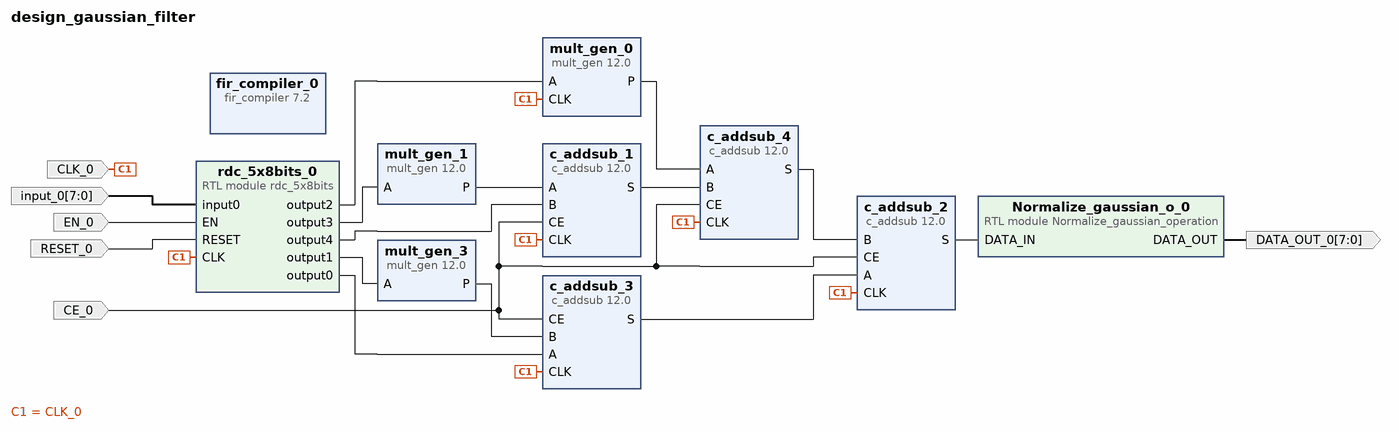
[diagram p0: block diagram of the top level]
# Vivado block design design_gaussian_filter, xc7z020clg400-1, Vivado 2018.2.1
create_bd_design design_gaussian_filter

create_bd_port -dir I -type clk CLK_0
set_property -dict {CONFIG.FREQ_HZ 10000000} [get_bd_ports CLK_0]
create_bd_port -dir I -from 7 -to 0 input_0
create_bd_port -dir I EN_0
create_bd_port -dir I -type rst RESET_0
create_bd_port -dir I -type ce CE_0
create_bd_port -dir O -from 7 -to 0 DATA_OUT_0

create_bd_cell -type ip -vlnv xilinx.com:ip:mult_gen:12.0 mult_gen_0
set_property -dict [list \
  CONFIG.MultType Constant_Coefficient_Multiplier \
  CONFIG.PortAType Unsigned \
  CONFIG.PortAWidth 8 \
  CONFIG.ConstValue 6 \
  CONFIG.PipeStages 2 \
] [get_bd_cells mult_gen_0]
create_bd_cell -type ip -vlnv xilinx.com:ip:mult_gen:12.0 mult_gen_1
set_property -dict [list \
  CONFIG.MultType Constant_Coefficient_Multiplier \
  CONFIG.PortAType Unsigned \
  CONFIG.PortAWidth 8 \
  CONFIG.ConstValue 4 \
] [get_bd_cells mult_gen_1]
create_bd_cell -type ip -vlnv xilinx.com:ip:mult_gen:12.0 mult_gen_3
set_property -dict [list \
  CONFIG.MultType Constant_Coefficient_Multiplier \
  CONFIG.PortAType Unsigned \
  CONFIG.PortAWidth 8 \
  CONFIG.ConstValue 4 \
] [get_bd_cells mult_gen_3]
create_bd_cell -type ip -vlnv xilinx.com:ip:c_addsub:12.0 c_addsub_1
set_property -dict [list \
  CONFIG.A_Type Signed \
  CONFIG.B_Type Unsigned \
  CONFIG.A_Width 11 \
  CONFIG.B_Width 8 \
  CONFIG.Out_Width 12 \
  CONFIG.Latency 1 \
  CONFIG.B_Value 00000000 \
] [get_bd_cells c_addsub_1]
create_bd_cell -type ip -vlnv xilinx.com:ip:c_addsub:12.0 c_addsub_2
set_property -dict [list \
  CONFIG.A_Type Signed \
  CONFIG.B_Type Signed \
  CONFIG.A_Width 12 \
  CONFIG.B_Width 13 \
  CONFIG.Out_Width 14 \
  CONFIG.Latency 1 \
  CONFIG.B_Value 0000000000000 \
] [get_bd_cells c_addsub_2]
create_bd_cell -type ip -vlnv xilinx.com:ip:c_addsub:12.0 c_addsub_3
set_property -dict [list \
  CONFIG.A_Type Unsigned \
  CONFIG.B_Type Signed \
  CONFIG.A_Width 8 \
  CONFIG.B_Width 11 \
  CONFIG.Out_Width 12 \
  CONFIG.Latency 1 \
  CONFIG.B_Value 00000000000 \
] [get_bd_cells c_addsub_3]
create_bd_cell -type ip -vlnv xilinx.com:ip:c_addsub:12.0 c_addsub_4
set_property -dict [list \
  CONFIG.A_Type Signed \
  CONFIG.B_Type Signed \
  CONFIG.A_Width 11 \
  CONFIG.B_Width 12 \
  CONFIG.Out_Width 13 \
  CONFIG.Latency 1 \
  CONFIG.B_Value 000000000000 \
] [get_bd_cells c_addsub_4]
create_bd_cell -type module -reference Normalize_gaussian_operation Normalize_gaussian_o_0
create_bd_cell -type module -reference rdc_5x8bits rdc_5x8bits_0
create_bd_cell -type ip -vlnv xilinx.com:ip:fir_compiler:7.2 fir_compiler_0
set_property -dict [list \
  CONFIG.CoefficientVector 1,4,7,4,1 \
  CONFIG.Coefficient_Sets 1 \
  CONFIG.Coefficient_Sign Unsigned \
  CONFIG.Quantization Integer_Coefficients \
  CONFIG.Coefficient_Width 16 \
  CONFIG.Coefficient_Fractional_Bits 0 \
  CONFIG.Coefficient_Structure Inferred \
  CONFIG.Data_Sign Unsigned \
  CONFIG.Data_Width 8 \
  CONFIG.Output_Rounding_Mode Truncate_LSBs \
  CONFIG.Output_Width 8 \
] [get_bd_cells fir_compiler_0]

# ---- connections ----

connect_bd_net -net CLK_0_1 [get_bd_ports CLK_0] \
  [get_bd_pins mult_gen_0/CLK] [get_bd_pins c_addsub_2/CLK] [get_bd_pins c_addsub_1/CLK] [get_bd_pins c_addsub_3/CLK] \
  [get_bd_pins c_addsub_4/CLK] [get_bd_pins rdc_5x8bits_0/CLK]
connect_bd_net -net input_0_1 [get_bd_ports input_0] [get_bd_pins rdc_5x8bits_0/input0]
connect_bd_net -net EN_0_1 [get_bd_ports EN_0] [get_bd_pins rdc_5x8bits_0/EN]
connect_bd_net -net RESET_0_1 [get_bd_ports RESET_0] [get_bd_pins rdc_5x8bits_0/RESET]
connect_bd_net -net CE_0_1 [get_bd_ports CE_0] \
  [get_bd_pins c_addsub_2/CE] [get_bd_pins c_addsub_1/CE] [get_bd_pins c_addsub_3/CE] [get_bd_pins c_addsub_4/CE]
connect_bd_net [get_bd_pins rdc_5x8bits_0/output2] [get_bd_pins mult_gen_0/A]
connect_bd_net [get_bd_pins rdc_5x8bits_0/output1] [get_bd_pins mult_gen_3/A]
connect_bd_net [get_bd_pins rdc_5x8bits_0/output3] [get_bd_pins mult_gen_1/A]
connect_bd_net [get_bd_pins mult_gen_3/P] [get_bd_pins c_addsub_3/B]
connect_bd_net [get_bd_pins mult_gen_1/P] [get_bd_pins c_addsub_1/A]
connect_bd_net [get_bd_pins rdc_5x8bits_0/output4] [get_bd_pins c_addsub_1/B]
connect_bd_net [get_bd_pins c_addsub_1/S] [get_bd_pins c_addsub_4/B]
connect_bd_net [get_bd_pins mult_gen_0/P] [get_bd_pins c_addsub_4/A]
connect_bd_net [get_bd_pins c_addsub_3/S] [get_bd_pins c_addsub_2/A]
connect_bd_net [get_bd_pins c_addsub_4/S] [get_bd_pins c_addsub_2/B]
connect_bd_net [get_bd_pins c_addsub_2/S] [get_bd_pins Normalize_gaussian_o_0/DATA_IN]
connect_bd_net [get_bd_pins Normalize_gaussian_o_0/DATA_OUT] [get_bd_ports DATA_OUT_0]
connect_bd_net [get_bd_pins rdc_5x8bits_0/output0] [get_bd_pins c_addsub_3/A]

validate_bd_design
save_bd_design
